# Altium schematic sheet Connector.SchDoc
size A3
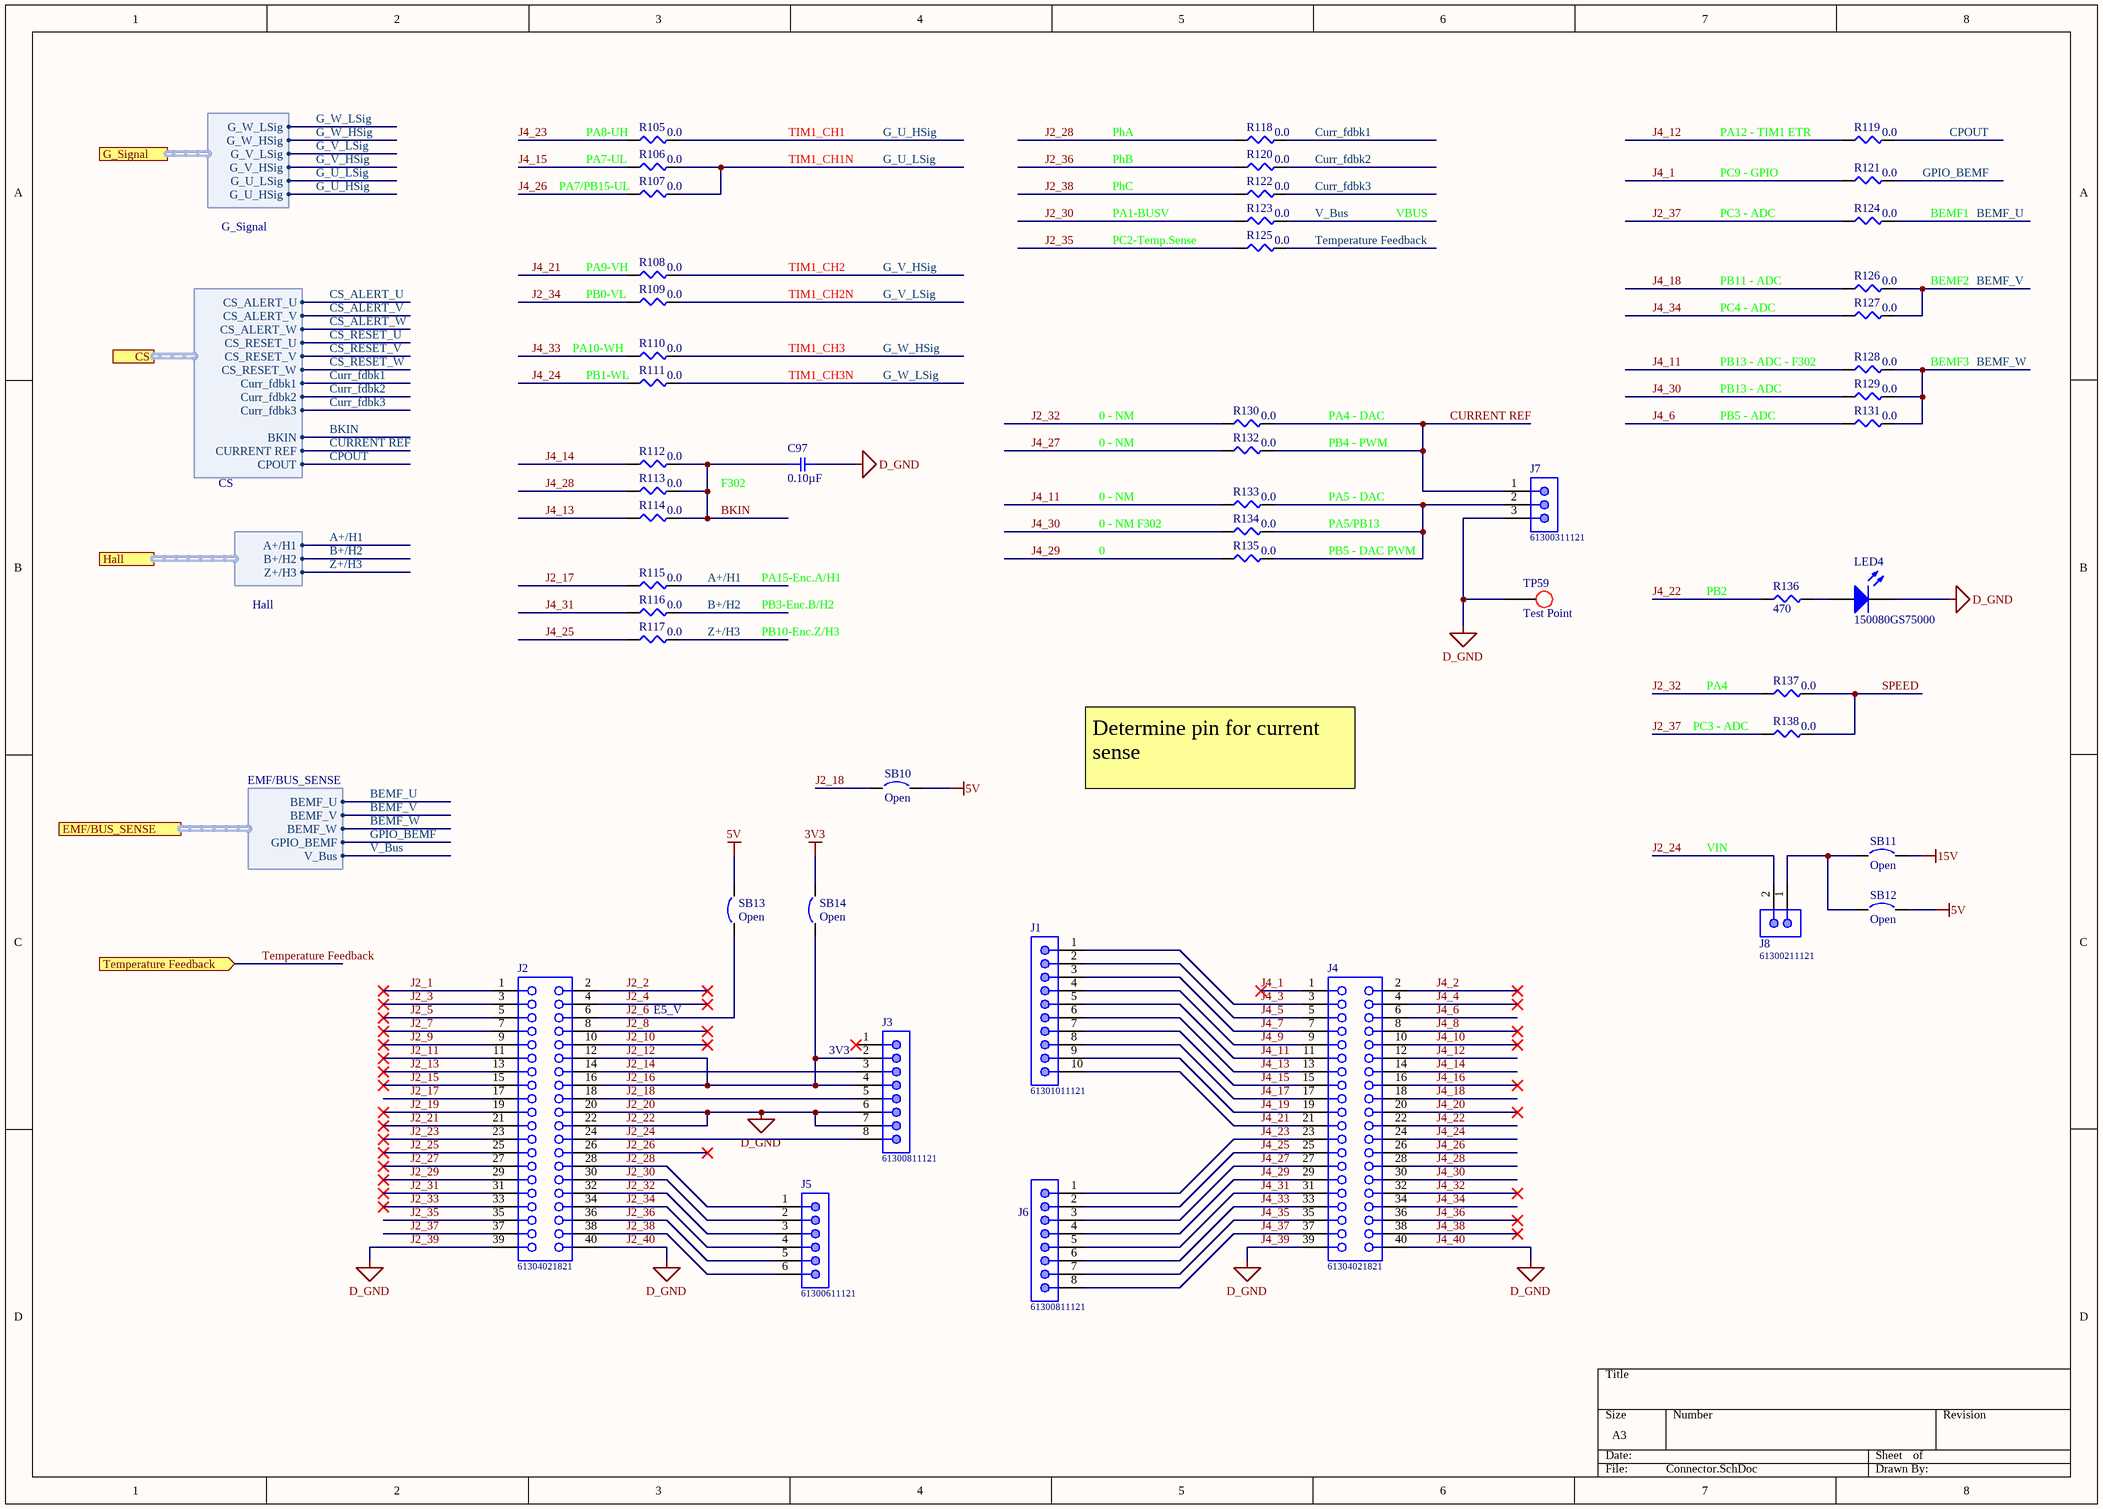
[diagram p0: Connector.SchDoc]

## Parts
C97  0.10µF  [SMD-0805C]
J1  61301011121  [61301011121]
J2  61304021821  [61304021821]
J3  61300811121  [61300811121]
J4  61304021821  [61304021821]
J5  61300611121  [61300611121]
J6  61300811121  [61300811121]
J7  61300311121  [61300311121]
J8  61300211121  [61300211121]
LED4  150080GS75000  [0805_A]
R105  0.0  [SMD-0603-RES]
R106  0.0  [SMD-0603-RES]
R107  0.0  [SMD-0603-RES]
R108  0.0  [SMD-0603-RES]
R109  0.0  [SMD-0603-RES]
R110  0.0  [SMD-0603-RES]
R111  0.0  [SMD-0603-RES]
R112  0.0  [SMD-0603-RES]
R113  0.0  [SMD-0603-RES]
R114  0.0  [SMD-0603-RES]
R115  0.0  [SMD-0603-RES]
R116  0.0  [SMD-0603-RES]
R117  0.0  [SMD-0603-RES]
R118  0.0  [SMD-0603-RES]
R119  0.0  [SMD-0603-RES]
R120  0.0  [SMD-0603-RES]
R121  0.0  [SMD-0603-RES]
R122  0.0  [SMD-0603-RES]
R123  0.0  [SMD-0603-RES]
R124  0.0  [SMD-0603-RES]
R125  0.0  [SMD-0603-RES]
R126  0.0  [SMD-0603-RES]
R127  0.0  [SMD-0603-RES]
R128  0.0  [SMD-0603-RES]
R129  0.0  [SMD-0603-RES]
R130  0.0  [SMD-0603-RES]
R131  0.0  [SMD-0603-RES]
R132  0.0  [SMD-0603-RES]
R133  0.0  [SMD-0603-RES]
R134  0.0  [SMD-0603-RES]
R135  0.0  [SMD-0603-RES]
R136  470  [SMD-0603-RES]
R137  0.0  [SMD-0603-RES]
R138  0.0  [SMD-0603-RES]
SB10  Open  [Solder Bridge - HP]  (no BOM)
SB11  Open  [Solder Bridge - HP]  (no BOM)
SB12  Open  [Solder Bridge - HP]  (no BOM)
SB13  Open  [Solder Bridge - HP]  (no BOM)
SB14  Open  [0805-Solder Bridge]  (no BOM)
TP59  Test Point  [Test_point_THT]  (no BOM)

## Ports
CS (harness CS), EMF/BUS_SENSE (harness EMF/BUS_SENSE), G_Signal (harness G_Signal), Hall (harness Hall), Temperature Feedback (in)

## Harnesses
G_Signal: G_U_HSig, G_U_LSig, G_V_HSig, G_V_LSig, G_W_HSig, G_W_LSig
CS: CS_ALERT_U, CS_ALERT_V, CS_ALERT_W, CS_RESET_U, CS_RESET_V, CS_RESET_W, Curr_fdbk1, Curr_fdbk2, Curr_fdbk3, BKIN, CURRENT REF, CPOUT
Hall: A+/H1, B+/H2, Z+/H3
EMF/BUS_SENSE: BEMF_U, BEMF_V, BEMF_W, GPIO_BEMF, V_Bus

## Nets
3V3: SB14.2
5V: SB10.2 SB12.2 SB13.2
15V: SB11.2
J2_20: C97.2 J2.20 J2.22 J2.39 J2.40 J3.6 J3.7 J4.39 J4.40 J7.3 LED4.1(K) TP59.1  [also labelled D_GND, J2_22, J2_39, J2_40, J4_39, J4_40]
A+/H1: R115.2 ; port Hall.A+/H1
B+/H2: R116.2 ; port Hall.B+/H2
BEMF_U: R124.2 ; port EMF/BUS_SENSE.BEMF_U
BEMF_V: R126.2 R127.2 ; port EMF/BUS_SENSE.BEMF_V
BEMF_W: R128.2 R129.2 R131.2 ; port EMF/BUS_SENSE.BEMF_W
BKIN: C97.1 R112.2 R113.2 R114.2 ; port CS.BKIN
CPOUT: R119.2 ; port CS.CPOUT
CS_ALERT_U: port CS.CS_ALERT_U
CS_ALERT_V: port CS.CS_ALERT_V
CS_ALERT_W: port CS.CS_ALERT_W
CS_RESET_U: port CS.CS_RESET_U
CS_RESET_V: port CS.CS_RESET_V
CS_RESET_W: port CS.CS_RESET_W
Curr_fdbk1: R118.2 ; port CS.Curr_fdbk1
Curr_fdbk2: R120.2 ; port CS.Curr_fdbk2
Curr_fdbk3: R122.2 ; port CS.Curr_fdbk3
CURRENT REF: J7.1 R130.2 R132.2 ; port CS.CURRENT REF
G_U_HSig: R105.2 ; port G_Signal.G_U_HSig
G_U_LSig: R106.2 R107.2 ; port G_Signal.G_U_LSig
G_V_HSig: R108.2 ; port G_Signal.G_V_HSig
G_V_LSig: R109.2 ; port G_Signal.G_V_LSig
G_W_HSig: R110.2 ; port G_Signal.G_W_HSig
G_W_LSig: R111.2 ; port G_Signal.G_W_LSig
GPIO_BEMF: R121.2 ; port EMF/BUS_SENSE.GPIO_BEMF
J2_1: J2.1
J2_2: J2.2
J2_3: J2.3
J2_4: J2.4
J2_5: J2.5
J2_6: J2.6 SB13.1
J2_7: J2.7
J2_8: J2.8
J2_9: J2.9
J2_10: J2.10
J2_11: J2.11
J2_12: J2.12 J2.16 J3.2 J3.4 SB14.1  [also labelled J2_16]
J2_13: J2.13
J2_14: J2.14 J3.3
J2_15: J2.15
J2_17: J2.17 R115.1
J2_18: J2.18 J3.5 SB10.1
J2_19: J2.19
J2_21: J2.21
J2_23: J2.23
J2_24: J2.24 J3.8 J8.2
J2_25: J2.25
J2_26: J2.26
J2_27: J2.27
J2_28: J2.28 J5.1 R118.1
J2_29: J2.29
J2_30: J2.30 J5.2 R123.1
J2_31: J2.31
J2_32: J2.32 J5.3 R130.1 R137.1
J2_33: J2.33
J2_34: J2.34 J5.4 R109.1
J2_35: J2.35 R125.1
J2_36: J2.36 J5.5 R120.1
J2_37: J2.37 R124.1 R138.1
J2_38: J2.38 J5.6 R122.1
J4_1: J4.1 R121.1
J4_2: J4.2
J4_3: J1.1 J4.3
J4_4: J4.4
J4_5: J1.2 J4.5
J4_6: J4.6 R131.1
J4_7: J1.3 J4.7
J4_8: J4.8
J4_9: J1.4 J4.9
J4_10: J4.10
J4_11: J1.5 J4.11 R128.1 R133.1
J4_12: J4.12 R119.1
J4_13: J1.6 J4.13 R114.1
J4_14: J4.14 R112.1
J4_15: J1.7 J4.15 R106.1
J4_16: J4.16
J4_17: J1.8 J4.17
J4_18: J4.18 R126.1
J4_19: J1.9 J4.19
J4_20: J4.20
J4_21: J1.10 J4.21 R108.1
J4_22: J4.22 R136.1
J4_23: J4.23 J6.1 R105.1
J4_24: J4.24 R111.1
J4_25: J4.25 J6.2 R117.1
J4_26: J4.26 R107.1
J4_27: J4.27 J6.3 R132.1
J4_28: J4.28 R113.1
J4_29: J4.29 J6.4 R135.1
J4_30: J4.30 R129.1 R134.1
J4_31: J4.31 J6.5 R116.1
J4_32: J4.32
J4_33: J4.33 J6.6 R110.1
J4_34: J4.34 R127.1
J4_35: J4.35 J6.7
J4_36: J4.36
J4_37: J4.37 J6.8
J4_38: J4.38
SPEED: R137.2 R138.2
Temperature Feedback: R125.2 ; port Temperature Feedback
V_Bus: R123.2 ; port EMF/BUS_SENSE.V_Bus
Z+/H3: R117.2 ; port Hall.Z+/H3
NetJ7_2: J7.2 R133.2 R134.2 R135.2
NetJ8_1: J8.1 SB11.1 SB12.1
NetLED4_2: LED4.2(A) R136.2

Not connected (* = marked no-connect by the designer): J3 1*

## Notes on the sheet
- (near R105) PA8-UH
- PA7-UL
- TIM1_CH1
- TIM1_CH1N
- PhA
- PhB
- PA12 - TIM1 ETR
- PC9 - GPIO
- PA7/PB15-UL
- PhC
- PA1-BUSV
- PC2-Temp.Sense
- VBUS
- PC3 - ADC
- BEMF1
- (near R108) PA9-VH
- PB0-VL
- TIM1_CH2
- TIM1_CH2N
- PB11 - ADC
- PC4 - ADC
- BEMF2
- PA10-WH
- PB1-WL
- TIM1_CH3
- TIM1_CH3N
- PB13 - ADC - F302
- BEMF3
- 0 - NM
- PA4 - DAC
- PB4 - PWM
- PB13 - ADC
- PB5 - ADC
- F302
- PA5 - DAC
- PA15-Enc.A/H1
- 0 - NM F302
- 0
- PA5/PB13
- PB5 - DAC PWM
- PB3-Enc.B/H2
- PB10-Enc.Z/H3
- (near R136) PB2
- PA4
- Determine pin for current sense
- VIN
- E5_V
- (near J3) 3V3

## Library data of the parts
C97 = GCD21BR71H104KA01L: CAP CER 0.1UF 50V X7R 0805; Manufacturer: Murata Electronics North America; Factory Stock: 0; Unit Price (USD): 0.24; Minimum Quantity: 1; Tolerance: ±10%; Datasheets: http://www.murata.com/~/media/webrenewal/support/library/catalog/products/capacitor/mlcc/c03e.ashx; Image: //media.digikey.com/Renders/Murata%20Renders/0805%28GxM6%29.jpg; Digi-Key Part Number: 490-11955-1-ND; Part Number: GCD21BR71H104KA01L; Quantity Available: 157; @ qty: 0; Packaging: Cut Tape (CT); Series: GCD; Part Status: Active; Value: 0.10µF; Voltage: 50V; Temperature Coefficient: X7R; Operating Temperature: -55°C ~ 125°C; Features: -; Ratings: AEC-Q200; Applications: Automotive; Mounting Type: Surface Mount, MLCC; Package / Case: 0805 (2012 Metric); Size / Dimension: 0.079" L x 0.049" W (2.00mm x 1.25mm); Height - Seated (Max): -; Thickness (Max): 0.049" (1.25mm); Lead Spacing: -; Lead Style: -
J1 = 61301011121: WR-PHD Pin Header, THT, pitch 2.54mm, Single Row, Vertical, 10pin; Pin Number: 10; Gender: Male; Rated Current: 3A; Working Voltage: 250VAC; Withstanding Voltage: 500VAC; Contact Resistance: 20mOhm; ComponentLink1Description: Manufacturer; ComponentLink1URL: http://www.we-online.de; ComponentLink2Description: Datasheet; ComponentLink2URL: https://katalog.we-online.de/em/datasheet/6130xx11121.pdf; Part Number: 61301011121; Published Date: June 2019; Publisher: Wurth Elektronik; Pitch: 2.54mm; Operating Temperature: -40 to +105degC; Mounting Technology: THT; Packaging: Bag; Row Number: Single; Orientation: Vertical
J2 J4 = 61304021821: WR-PHD Socket Header, THT, pitch 2.54mm, Dual Row, Vertical, 40pin; Pin Number: 40; Gender: Female; Rated Current: 3A; Working Voltage: 250VAC; Withstanding Voltage: 500VAC; Contact Resistance: 20mOhm; ComponentLink1Description: Manufacturer; ComponentLink1URL: http://www.we-online.de; ComponentLink2Description: Datasheet; ComponentLink2URL: https://katalog.we-online.de/em/datasheet/6130xx21821.pdf; Part Number: 61304021821; Published Date: June 2019; Publisher: Wurth Elektronik; Pitch: 2.54mm; Operating Temperature: -40 to +125degC; Mounting Technology: THT; Packaging: Tray; Row Number: Dual; Orientation: Vertical
J3 J6 = 61300811121: WR-PHD Pin Header, THT, pitch 2.54mm, Single Row, Vertical, 8pin; Pin Number: 8; Gender: Male; Rated Current: 3A; Working Voltage: 250VAC; Withstanding Voltage: 500VAC; Contact Resistance: 20mOhm; ComponentLink1Description: Manufacturer; ComponentLink1URL: http://www.we-online.de; ComponentLink2Description: Datasheet; ComponentLink2URL: https://katalog.we-online.de/em/datasheet/6130xx11121.pdf; Part Number: 61300811121; Published Date: June 2019; Publisher: Wurth Elektronik; Pitch: 2.54mm; Operating Temperature: -40 to +105degC; Mounting Technology: THT; Packaging: Bag; Row Number: Single; Orientation: Vertical
J5 = 61300611121: WR-PHD Pin Header, THT, pitch 2.54mm, Single Row, Vertical, 6pin; Pin Number: 6; Gender: Male; Rated Current: 3A; Working Voltage: 250VAC; Withstanding Voltage: 500VAC; Contact Resistance: 20mOhm; ComponentLink1Description: Manufacturer; ComponentLink1URL: http://www.we-online.de; ComponentLink2Description: Datasheet; ComponentLink2URL: https://katalog.we-online.de/em/datasheet/6130xx11121.pdf; Part Number: 61300611121; Published Date: June 2019; Publisher: Wurth Elektronik; Pitch: 2.54mm; Operating Temperature: -40 to +105degC; Mounting Technology: THT; Packaging: Bag; Row Number: Single; Orientation: Vertical
J7 = 61300311121: WR-PHD Pin Header, THT, pitch 2.54mm, Single Row, Vertical, 3pin; Pin Number: 3; Gender: Male; Rated Current: 3A; Working Voltage: 250VAC; Withstanding Voltage: 500VAC; Contact Resistance: 20mOhm; ComponentLink1Description: Manufacturer; ComponentLink1URL: http://www.we-online.de; ComponentLink2Description: Datasheet; ComponentLink2URL: https://katalog.we-online.de/em/datasheet/6130xx11121.pdf; Part Number: 61300311121; Published Date: June 2019; Publisher: Wurth Elektronik; Pitch: 2.54mm; Operating Temperature: -40 to +105degC; Mounting Technology: THT; Packaging: Bag; Row Number: Single; Orientation: Vertical
J8 = 61300211121: WR-PHD Pin Header, THT, pitch 2.54mm, Single Row, Vertical, 2pin; Pin Number: 2; Gender: Male; Rated Current: 3A; Working Voltage: 250VAC; Withstanding Voltage: 500VAC; Contact Resistance: 20mOhm; ComponentLink1Description: Manufacturer; ComponentLink1URL: http://www.we-online.de; ComponentLink2Description: Datasheet; ComponentLink2URL: https://katalog.we-online.de/em/datasheet/6130xx11121.pdf; Part Number: 61300211121; Published Date: June 2019; Publisher: Wurth Elektronik; Pitch: 2.54mm; Operating Temperature: -40 to +105degC; Mounting Technology: THT; Packaging: Bag; Row Number: Single; Orientation: Vertical
LED4 = 150080GS75000: SMD mono-color Chip LED, WL-SMCW, Green; PackageReference: 0805_A; Color: Green; PartNumber: 150080GS75000; ComponentLink1Description: Manufacturer URL; ComponentLink1URL: http://www.we-online.com; ComponentLink2Description: Datasheet; ComponentLink2URL: http://katalog.we-online.com/led/datasheet/150080GS75000.pdf
R105-R135 R137 R138 = ERJ-3GEY0R00V: RES SMD 0.0OHM JUMPER 1/10W 0603; Manufacturer: Panasonic Electronic Components; Factory Stock: 0; Unit Price (USD): 0.00352; @ qty: 1500; Minimum Quantity: 1; Power (Watts): 0.1W, 1/10W; Part Number: ERJ-3GEY0R00V; Datasheets: http://industrial.panasonic.com/www-cgi/jvcr13pz.cgi?E+PZ+3+AOA0001+ERJ3GEY0R00V+7+WW; Image: //media.digikey.com/Photos/Panasonic%20Photos/MFG_ERJ-P6W%20Series.jpg; Digi-Key Part Number: P0.0GCT-ND; Quantity Available: 4813372; Packaging: Cut Tape (CT); Series: ERJ; Part Status: Active; Value: 0.0; Tolerance: Jumper; Composition: Thick Film; Features: Automotive AEC-Q200; Temperature Coefficient: -; Operating Temperature: -55°C ~ 155°C; Package / Case: 0603 (1608 Metric); Supplier Device Package: 0603; Size / Dimension: 0.063" L x 0.031" W (1.60mm x 0.80mm); Height - Seated (Max): 0.022" (0.55mm); Number of Terminations: 2; Failure Rate: -
R136 = ERJ-3EKF4700V: RES SMD 470 OHM 1% 1/10W 0603; Manufacturer: Panasonic Electronic Components; Factory Stock: 0; Unit Price (USD): 0.00379; @ qty: 1500; Minimum Quantity: 1; Power (Watts): 0.1W, 1/10W; Temperature Coefficient: ±100ppm/°C; Part Number: ERJ-3EKF4700V; Datasheets: http://industrial.panasonic.com/www-cgi/jvcr13pz.cgi?E+PZ+3+AOA0002+ERJ3EKF4700V+7+WW; Image: //media.digikey.com/Photos/Panasonic%20Photos/MFG_ERJ-P6W%20Series.jpg; Digi-Key Part Number: P470HCT-ND; Quantity Available: 553629; Packaging: Cut Tape (CT); Series: ERJ; Part Status: Active; Value: 470; Tolerance: ±1%; Composition: Thick Film; Features: Automotive AEC-Q200; Operating Temperature: -55°C ~ 155°C; Package / Case: 0603 (1608 Metric); Supplier Device Package: 0603; Size / Dimension: 0.063" L x 0.031" W (1.60mm x 0.80mm); Height - Seated (Max): 0.022" (0.55mm); Number of Terminations: 2; Failure Rate: -
SB10-SB14 = Solder Bridge: Circuit Breaker; Published: 24-Mar-1999; Revision: July-2002: Re-released for DXP Platform.; Publisher: Altium Limited